# EAGLE design 7segement4digits1badidea-mk-4.2-smd (EAGLE 6.5.0)
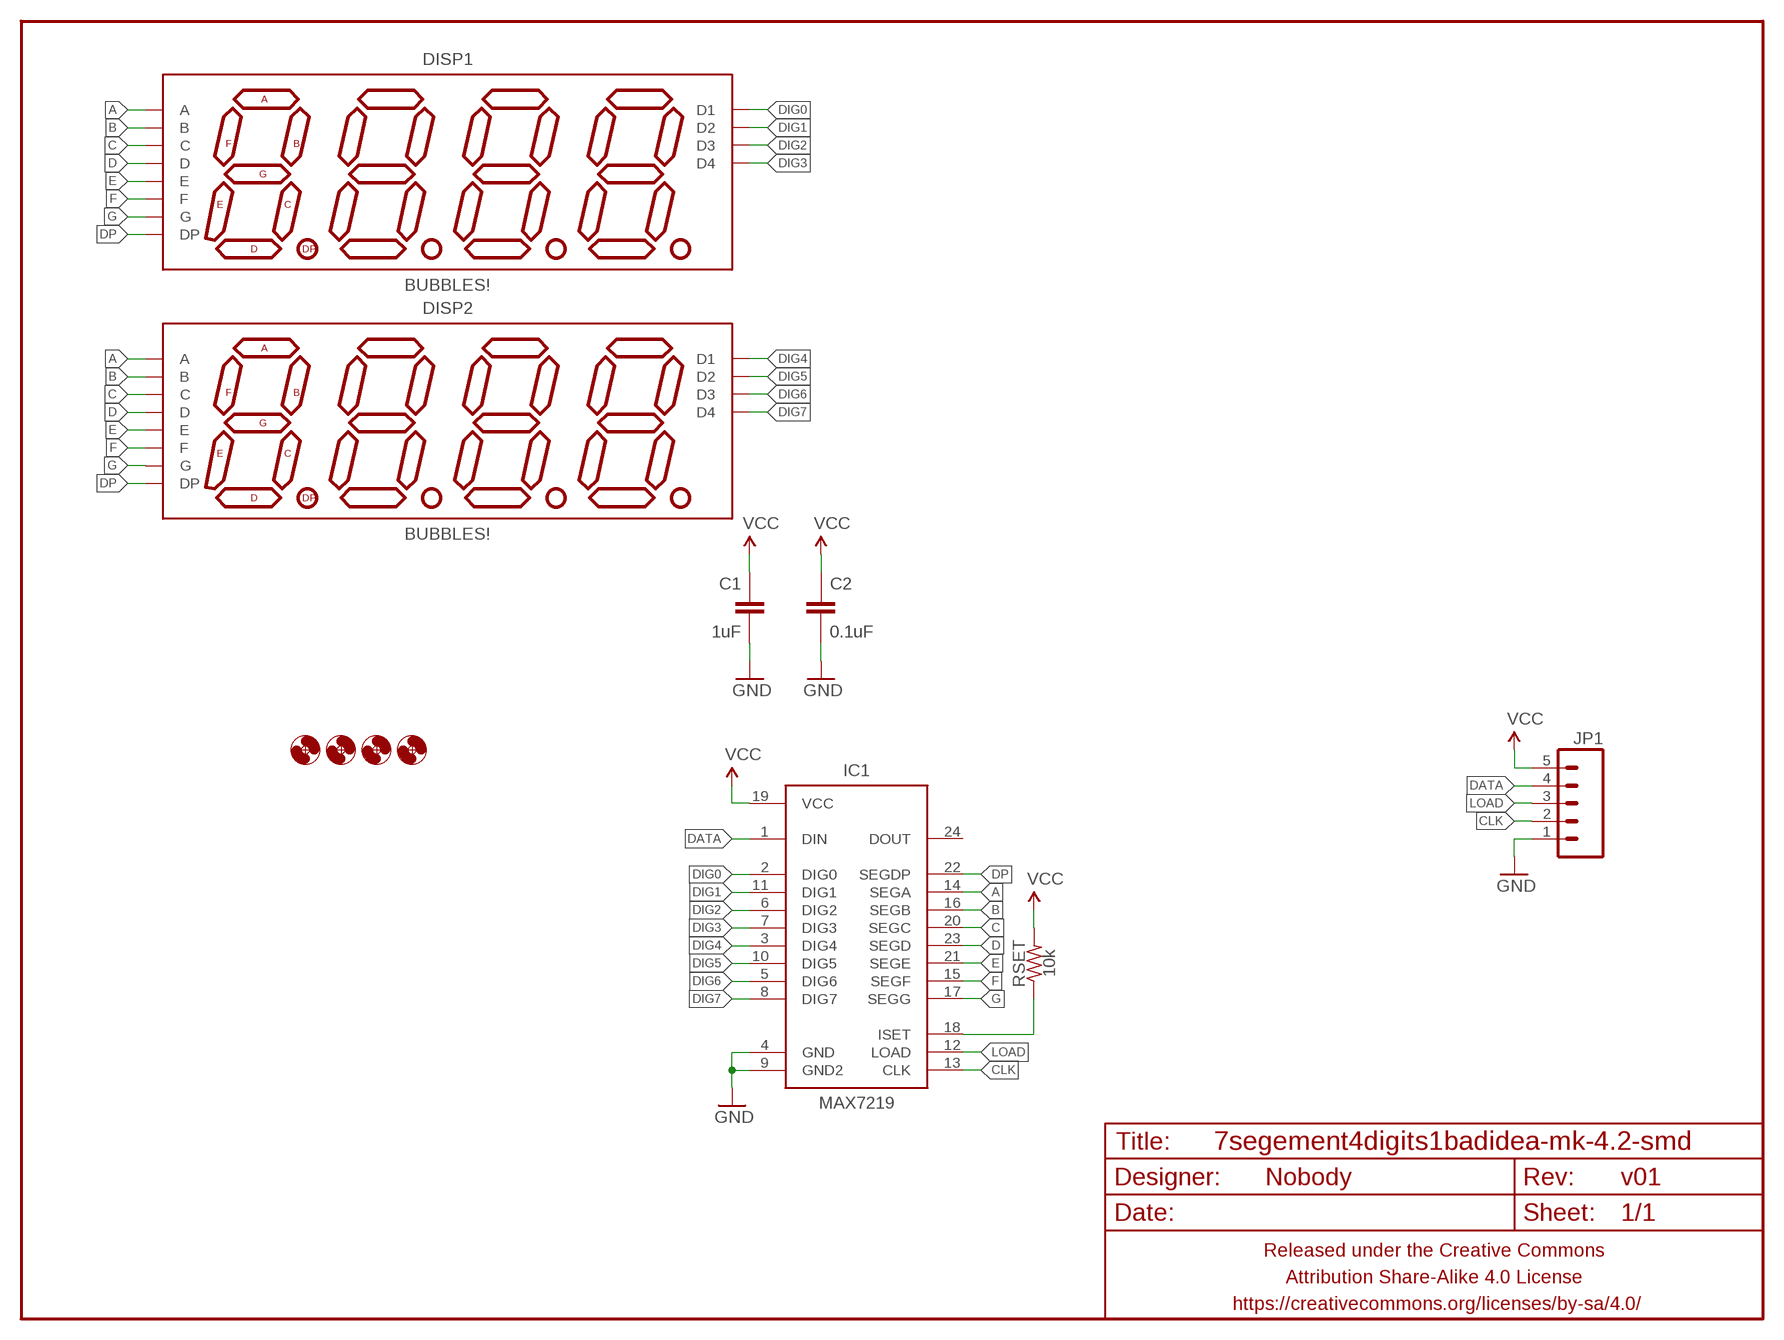
[diagram p0: schematic, sheet 1]

## Parts
C1  1uF  CAPACITOR-CERAMIC025-024X044  [C025-024X044]
C2  0.1uF  CAPACITOR-CERAMIC025-024X044  [C025-024X044]
DISP1  BUBBLES!  7SEG_4DIGITHP-BUBBLE  [DIL12]
DISP2  BUBBLES!  7SEG_4DIGITHP-BUBBLE  [DIL12]
FRAME1  FRAME-LETTERNO_PACKAGE  [DUMMY]
H1  HOLE#2  [HOLE-#2]
H2  HOLE#2  [HOLE-#2]
H3  HOLE#2  [HOLE-#2]
H4  HOLE#2  [HOLE-#2]
IC1  MAX7219  MAX7219SOIC-W  [SO24W]
JP1  M05PTH  [1X05]
RSET  10k  RESISTORPTH-AXIAL-6.35MM  [RESISTOR-AXIAL-PTH-6.35MM]

## Nets
A: DISP1.12(A) DISP2.12(A) IC1.14(SEGA)
B: DISP1.11(B) DISP2.11(B) IC1.16(SEGB)
C: DISP1.3(C) DISP2.3(C) IC1.20(SEGC)
CLK: IC1.13(CLK) JP1.2
D: DISP1.8(D) DISP2.8(D) IC1.23(SEGD)
DATA: IC1.1(DIN) JP1.4
DIG0: DISP1.1(D1) IC1.2(DIG0)
DIG1: DISP1.10(D2) IC1.11(DIG1)
DIG2: DISP1.4(D3) IC1.6(DIG2)
DIG3: DISP1.6(D4) IC1.7(DIG3)
DIG4: DISP2.1(D1) IC1.3(DIG4)
DIG5: DISP2.10(D2) IC1.10(DIG5)
DIG6: DISP2.4(D3) IC1.5(DIG6)
DIG7: DISP2.6(D4) IC1.8(DIG7)
DP: DISP1.5(DP) DISP2.5(DP) IC1.22(SEGDP)
E: DISP1.2(E) DISP2.2(E) IC1.21(SEGE)
F: DISP1.9(F) DISP2.9(F) IC1.15(SEGF)
G: DISP1.7(G) DISP2.7(G) IC1.17(SEGG)
GND: C1.2 C2.2 IC1.4(GND) IC1.9(GND2) JP1.1
LOAD: IC1.12(LOAD) JP1.3
N$1: IC1.18(ISET) RSET.P$1
VCC: C1.1 C2.1 IC1.19(VCC) JP1.5 RSET.P$2
Unconnected: IC1.24(DOUT)

## Library data of the parts
C1 C2 = A_butts:CAPACITOR-CERAMIC: CAPACITOR, European symbol
DISP1 DISP2 = A_butts:7SEG_4DIGIT; STOREFRONT: COM-12710
FRAME1 = A_butts:FRAME-LETTER: Schematic Frame Standard 8.5x11 US Letter frame; DESIGNER: Nobody; VERSION: v01
H1-H4 = A_butts:HOLE: MOUNTING HOLE with drill center marker
IC1 = A_butts:MAX7219: 8-digit, 8-segment LED display driver, serial input
JP1 = A_butts:M05: Header 5 Standard 5-pin 0.1" header. Use with straight break away headers (SKU : PRT-00116), right angle break away headers (PRT-00553), swiss pins (PRT-00743), machine pins (PRT-00117), and female headers (PRT-00115). Molex polarized connector foot print use with SKU : PRT-08230 with associated crimp pins and housings.
RSET = A_butts:RESISTOR: RESISTOR, American symbol

## Board
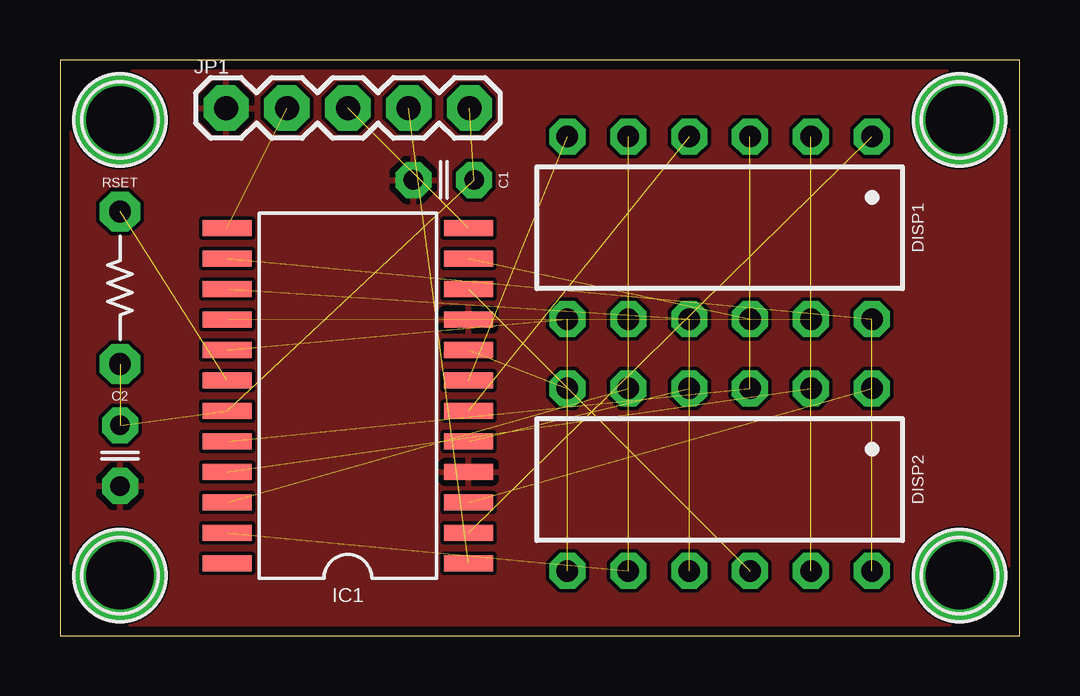
[diagram p1: board, top side]
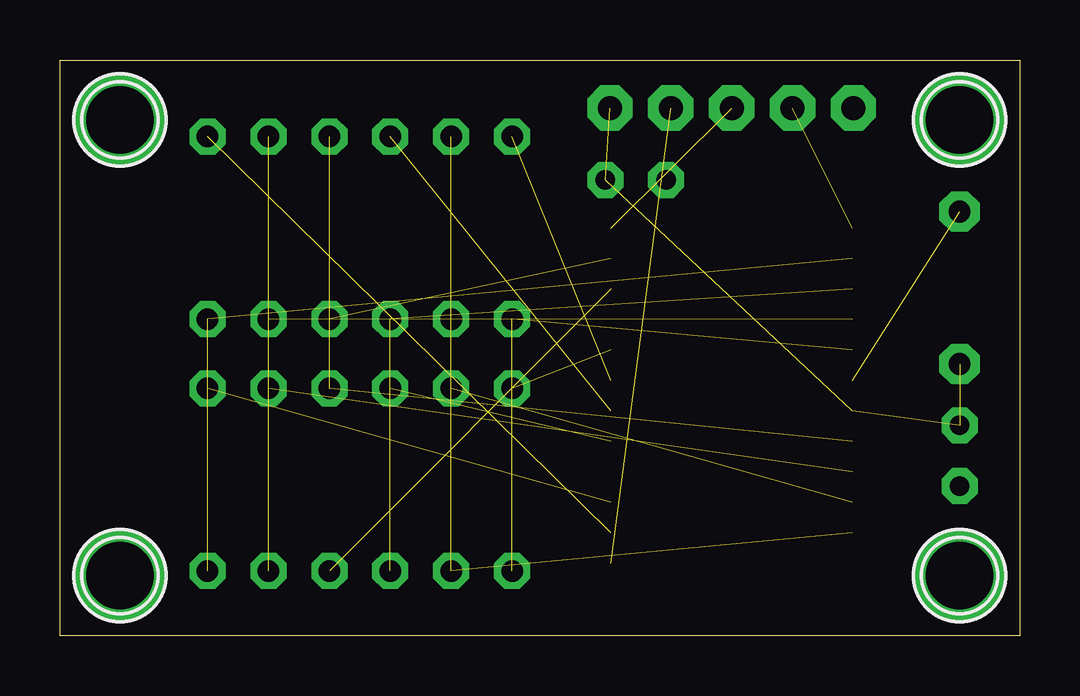
[diagram p2: board, bottom side, seen from below]

Size 40 x 24 mm. Coordinates in mm from the lower left corner, seen from the top.
Outline: 0,0 40,0 40,24 0,24 0,0
Copper layers (1*16): Top 0.0356mm / dielectric 1.5011mm / Bottom 0.0356mm
Design rules "LaenPCBOrder_2": minimum track width 6mil, minimum drill 13mil, track to track 6mil, track to pad 6mil, pad to pad 6mil, via to via 6mil, smd to smd 6mil, copper to edge 15mil, drill to drill 6mil, minimum pad ring 7mil, minimum via ring 7mil, stop-mask expansion 3mil, vias tented up to drill 20mil, thermal gap 10mil

### Footprints (pad centres in the part's own frame; a part is rotated, then mirrored left to right if it is on the bottom)
C025-024X044 = drill 0.813 pad 1.5 octagon: 1 -1.27,0; 2 1.27,0
DIL12 = drill 0.9 pad 1.5 octagon: 1 -6.35,-3.81; 2 -3.81,-3.81; 3 -1.27,-3.81; 4 1.27,-3.81; 5 3.81,-3.81; 6 6.35,-3.81; 7 6.35,3.81; 8 3.81,3.81; 9 1.27,3.81; 10 -1.27,3.81; 11 -3.81,3.81; 12 -6.35,3.81
HOLE-#2 = drill 2.8 pad 3.81: P$1 0,0
SO24W = smd 0.66 x 2.032: 1 -6.985,-5.029; 2 -5.715,-5.029; 3 -4.445,-5.029; 4 -3.175,-5.029; 5 -1.905,-5.029; 6 -0.635,-5.029; 7 0.635,-5.029; 8 1.905,-5.029; 9 3.175,-5.029; 10 4.445,-5.029; 11 5.715,-5.029; 12 6.985,-5.029; 13 6.985,5.029; 14 5.715,5.029; 15 4.445,5.029; 16 3.175,5.029; 17 1.905,5.029; 18 0.635,5.029; 19 -0.635,5.029; 20 -1.905,5.029; 21 -3.175,5.029; 22 -4.445,5.029; 23 -5.715,5.029; 24 -6.985,5.029
1X05 = drill 1 pad 1.88 octagon: 1 0,0; 2 2.54,0; 3 5.08,0; 4 7.62,0; 5 10.16,0
RESISTOR-AXIAL-PTH-6.35MM = drill 0.9 pad 1.676 octagon: P$1 -3.175,0; P$2 3.175,0

### Placement (x,y rotation side)
C1  16,19 180 top
C2  2.5,7.5 270 top
DISP1  27.5,17 180 top
DISP2  27.5,6.5 180 top
FRAME1  0,0 0 top
H1  2.5,2.5 0 top
H2  37.5,2.5 0 top
H3  2.5,21.5 0 top
H4  37.5,21.5 0 top
IC1  12,10 90 top
JP1  6.92,22 0 top
RSET  2.5,14.5 270 top

### Tracks (layer width: path | path; a pad name or v marks a point on that pad's centre or on a via)
A  (2 unrouted)
B  (2 unrouted)
C  (2 unrouted)
CLK  (1 unrouted)
D  (2 unrouted)
DATA  (1 unrouted)
DIG0  (1 unrouted)
DIG1  (1 unrouted)
DIG2  (1 unrouted)
DIG3  (1 unrouted)
DIG4  (1 unrouted)
DIG5  (1 unrouted)
DIG6  (1 unrouted)
DIG7  (1 unrouted)
DP  (2 unrouted)
E  (2 unrouted)
F  (2 unrouted)
G  (2 unrouted)
GND
  pour Top: 0,0 40,0 40,24 0,24
LOAD  (1 unrouted)
N$1  (1 unrouted)
VCC  (4 unrouted)